# EAGLE board csa_auxcpu-v1.0c (EAGLE 4.15)
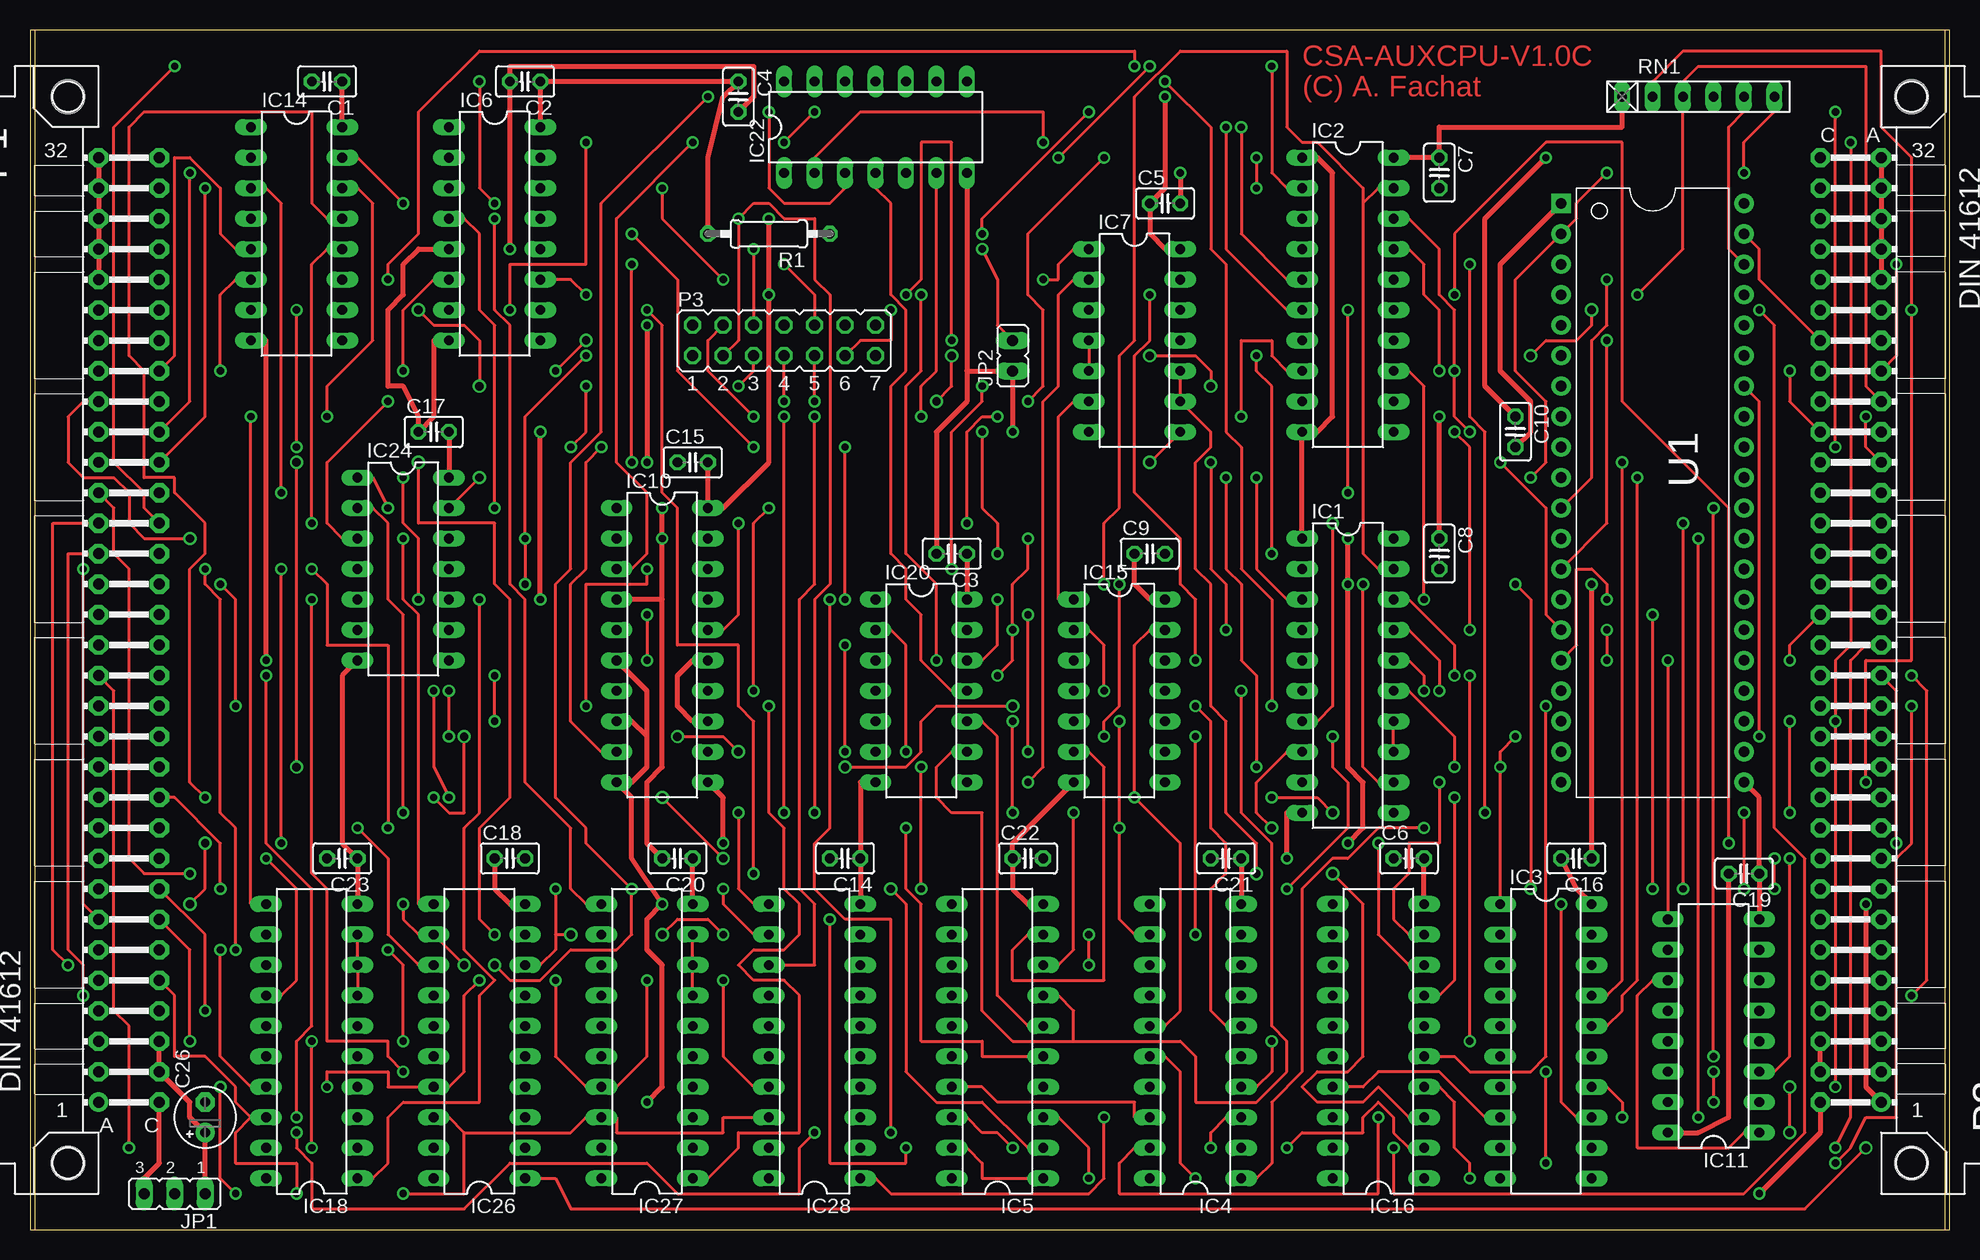
[diagram p2: board, top side]
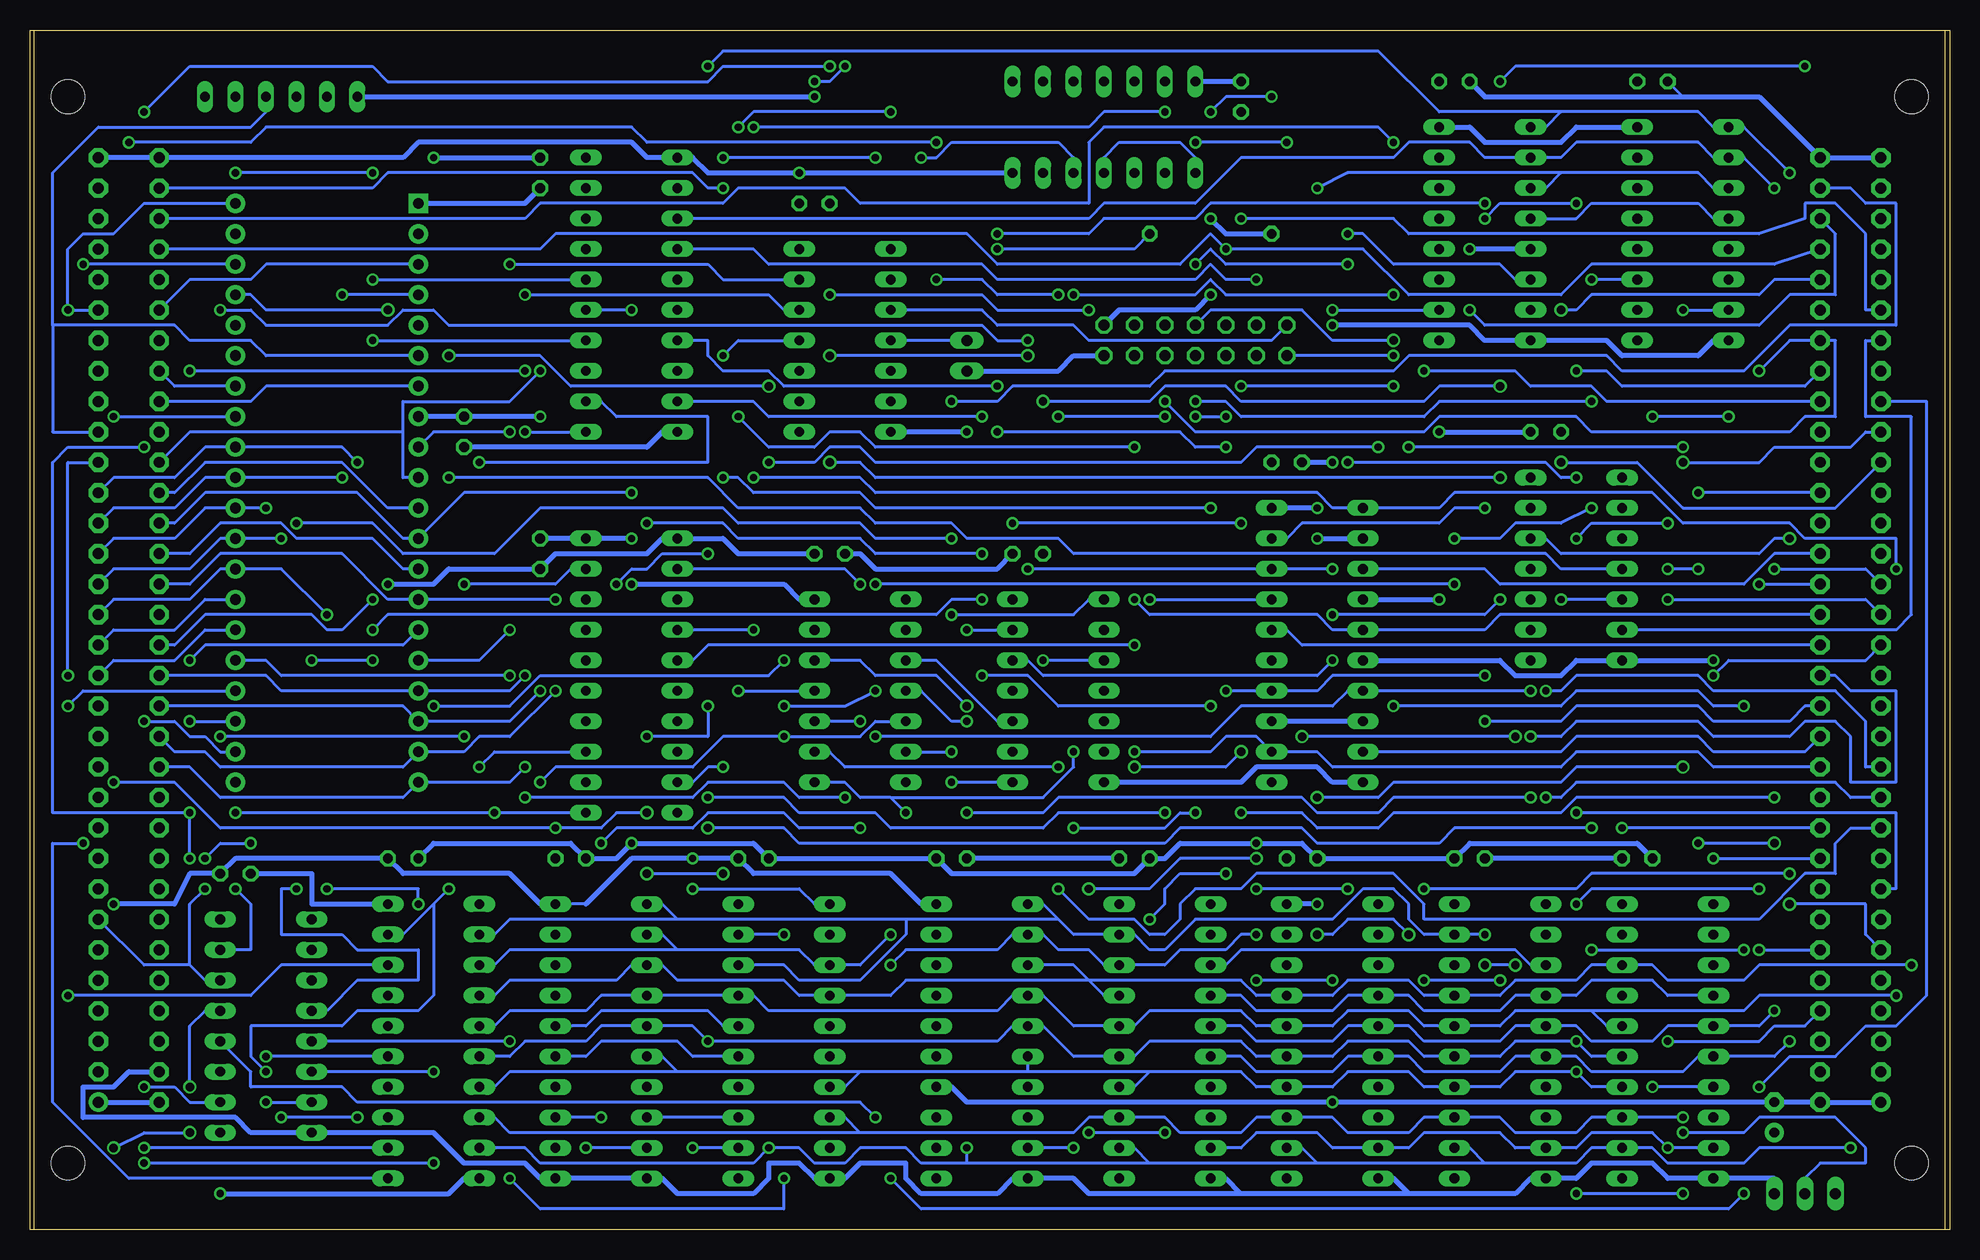
[diagram p3: board, bottom side, seen from below]

Size 160 x 100.03 mm. Coordinates in mm from the lower left corner, seen from the top.
Outline: 0,0.01 160,0.01 160,100.01 0,100.01 0,0.01
Copper layers (1*16): Top 0.035mm / dielectric 1.5mm / Bottom 0.035mm
Design rules "default": minimum track width 10mil, minimum drill 24mil, track to track 8mil, track to pad 8mil, pad to pad 8mil, via to via 8mil, smd to smd 8mil, copper to edge 40mil, drill to drill 8mil, minimum pad ring 10mil, minimum via ring 8mil, stop-mask expansion 4mil, vias tented up to drill 0mil, thermal gap 10mil

## Footprints (pad centres in the part's own frame; a part is rotated, then mirrored left to right if it is on the bottom)
C025-025X050 = drill 0.813 octagon: 1 -1.27,0; 2 1.27,0
E2,5-5 = drill 0.813 pad 1.6 round: + -1.27,0 | drill 0.813 pad 1.6 octagon: - 1.27,0
DIL20 = drill 0.813 long: 1 -11.43,-3.81; 2 -8.89,-3.81; 3 -6.35,-3.81; 4 -3.81,-3.81; 5 -1.27,-3.81; 6 1.27,-3.81; 7 3.81,-3.81; 8 6.35,-3.81; 9 8.89,-3.81; 10 11.43,-3.81; 11 11.43,3.81; 12 8.89,3.81; 13 6.35,3.81; 14 3.81,3.81; 15 1.27,3.81; 16 -1.27,3.81; 17 -3.81,3.81; 18 -6.35,3.81; 19 -8.89,3.81; 20 -11.43,3.81
DIL20' = drill 0.813 long: 1 -10.16,-3.81; 2 -7.62,-3.81; 3 -5.08,-3.81; 4 -2.54,-3.81; 5 0,-3.81; 6 2.54,-3.81; 7 5.08,-3.81; 8 7.62,-3.81; 9 10.16,-3.81; 10 12.7,-3.81; 11 12.7,3.81; 12 10.16,3.81; 13 7.62,3.81; 14 5.08,3.81; 15 2.54,3.81; 16 0,3.81; 17 -2.54,3.81; 18 -5.08,3.81; 19 -7.62,3.81; 20 -10.16,3.81
DIL16 = drill 0.813 long: 1 -8.89,-3.81; 2 -6.35,-3.81; 3 -3.81,-3.81; 4 -1.27,-3.81; 5 1.27,-3.81; 6 3.81,-3.81; 7 6.35,-3.81; 8 8.89,-3.81; 9 8.89,3.81; 10 6.35,3.81; 11 3.81,3.81; 12 1.27,3.81; 13 -1.27,3.81; 14 -3.81,3.81; 15 -6.35,3.81; 16 -8.89,3.81
DIL14 = drill 0.813 long: 1 -7.62,-3.81; 2 -5.08,-3.81; 3 -2.54,-3.81; 4 0,-3.81; 5 2.54,-3.81; 6 5.08,-3.81; 7 7.62,-3.81; 8 7.62,3.81; 9 5.08,3.81; 10 2.54,3.81; 11 0,3.81; 12 -2.54,3.81; 13 -5.08,3.81; 14 -7.62,3.81
JP2 = drill 0.914 long: 1 -2.54,0; 2 0,0; 3 2.54,0
JP1 = drill 0.914 long: 1 0,-1.27; 2 0,1.27
CSABUS = drill 0.914 pad 1.6 round: A1 7.62,36.83 | drill 0.914 pad 1.6 octagon: A2 7.62,34.29; A3 7.62,31.75; A4 7.62,29.21; A5 7.62,26.67; A6 7.62,24.13; A7 7.62,21.59; A8 7.62,19.05; A9 7.62,16.51; A10 7.62,13.97; A11 7.62,11.43; A12 7.62,8.89; A13 7.62,6.35; A14 7.62,3.81; A15 7.62,1.27; A16 7.62,-1.27; A17 7.62,-3.81; A18 7.62,-6.35; A19 7.62,-8.89; A20 7.62,-11.43; A21 7.62,-13.97; A22 7.62,-16.51; A23 7.62,-19.05; A24 7.62,-21.59; A25 7.62,-24.13; A26 7.62,-26.67; A27 7.62,-29.21; A28 7.62,-31.75; A29 7.62,-34.29; A30 7.62,-36.83; A31 7.62,-39.37; A32 7.62,-41.91; C1 2.54,36.83; C2 2.54,34.29; C3 2.54,31.75; C4 2.54,29.21; C5 2.54,26.67; C6 2.54,24.13; C7 2.54,21.59; C8 2.54,19.05; C9 2.54,16.51; C10 2.54,13.97; C11 2.54,11.43; C12 2.54,8.89; C13 2.54,6.35; C14 2.54,3.81; C15 2.54,1.27; C16 2.54,-1.27; C17 2.54,-3.81; C18 2.54,-6.35; C19 2.54,-8.89; C20 2.54,-11.43; C21 2.54,-13.97; C22 2.54,-16.51; C23 2.54,-19.05; C24 2.54,-21.59; C25 2.54,-24.13; C26 2.54,-26.67; C27 2.54,-29.21; C28 2.54,-31.75; C29 2.54,-34.29; C30 2.54,-36.83; C31 2.54,-39.37; C32 2.54,-41.91 | hole 2.794: 10.16,41.91; 10.16,-46.99
CSABUSSOCK = drill 0.914 pad 1.6 round: A1 -7.62,-39.37 | drill 0.914 pad 1.6 octagon: A2 -7.62,-36.83; A3 -7.62,-34.29; A4 -7.62,-31.75; A5 -7.62,-29.21; A6 -7.62,-26.67; A7 -7.62,-24.13; A8 -7.62,-21.59; A9 -7.62,-19.05; A10 -7.62,-16.51; A11 -7.62,-13.97; A12 -7.62,-11.43; A13 -7.62,-8.89; A14 -7.62,-6.35; A15 -7.62,-3.81; A16 -7.62,-1.27; A17 -7.62,1.27; A18 -7.62,3.81; A19 -7.62,6.35; A20 -7.62,8.89; A21 -7.62,11.43; A22 -7.62,13.97; A23 -7.62,16.51; A24 -7.62,19.05; A25 -7.62,21.59; A26 -7.62,24.13; A27 -7.62,26.67; A28 -7.62,29.21; A29 -7.62,31.75; A30 -7.62,34.29; A31 -7.62,36.83; A32 -7.62,39.37; C1 -12.7,-39.37; C2 -12.7,-36.83; C3 -12.7,-34.29; C4 -12.7,-31.75; C5 -12.7,-29.21; C6 -12.7,-26.67; C7 -12.7,-24.13; C8 -12.7,-21.59; C9 -12.7,-19.05; C10 -12.7,-16.51; C11 -12.7,-13.97; C12 -12.7,-11.43; C13 -12.7,-8.89; C14 -12.7,-6.35; C15 -12.7,-3.81; C16 -12.7,-1.27; C17 -12.7,1.27; C18 -12.7,3.81; C19 -12.7,6.35; C20 -12.7,8.89; C21 -12.7,11.43; C22 -12.7,13.97; C23 -12.7,16.51; C24 -12.7,19.05; C25 -12.7,21.59; C26 -12.7,24.13; C27 -12.7,26.67; C28 -12.7,29.21; C29 -12.7,31.75; C30 -12.7,34.29; C31 -12.7,36.83; C32 -12.7,39.37 | hole 2.794: -5.08,44.45; -5.08,-44.45
FLAT14 = drill 0.914 octagon: 1 -7.62,-1.27; 2 -5.08,-1.27; 3 -2.54,-1.27; 4 0,-1.27; 5 2.54,-1.27; 6 5.08,-1.27; 7 7.62,-1.27; A -7.62,1.27; B -5.08,1.27; C -2.54,1.27; D 0,1.27; E 2.54,1.27; F 5.08,1.27; G 7.62,1.27
0207/10 = drill 0.813 octagon: 1 -5.08,0; 2 5.08,0
RN-6 = drill 0.813 long: 1 -6.35,0; 2 -3.81,0; 3 -1.27,0; 4 1.27,0; 5 3.81,0; 6 6.35,0
DIP-40 = drill 0.889 pad 1.6 square: 1 -22.86,-7.62 | drill 0.889 pad 1.6 round: 2 -20.32,-7.62; 3 -17.78,-7.62; 4 -15.24,-7.62; 5 -12.7,-7.62; 6 -10.16,-7.62; 7 -7.62,-7.62; 8 -5.08,-7.62; 9 -2.54,-7.62; 10 0,-7.62; 11 2.54,-7.62; 12 5.08,-7.62; 13 7.62,-7.62; 14 10.16,-7.62; 15 12.7,-7.62; 16 15.24,-7.62; 17 17.78,-7.62; 18 20.32,-7.62; 19 22.86,-7.62; 20 25.4,-7.62; 21 25.4,7.62; 22 22.86,7.62; 23 20.32,7.62; 24 17.78,7.62; 25 15.24,7.62; 26 12.7,7.62; 27 10.16,7.62; 28 7.62,7.62; 29 5.08,7.62; 30 2.54,7.62; 31 0,7.62; 32 -2.54,7.62; 33 -5.08,7.62; 34 -7.62,7.62; 35 -10.16,7.62; 36 -12.7,7.62; 37 -15.24,7.62; 38 -17.78,7.62; 39 -20.32,7.62; 40 -22.86,7.62

## Placement (x,y rotation side)
C1  100n  [C025-025X050]  24.76,95.73 180 top
C2  100n  [C025-025X050]  41.27,95.73 180 top
C3  100n  [C025-025X050]  76.83,56.36 180 top
C4  100n  [C025-025X050]  59.05,94.46 270 top
C5  100n  [C025-025X050]  94.61,85.57 0 top
C6  100n  [C025-025X050]  114.93,30.96 0 top
C7  100n  [C025-025X050]  117.47,88.11 270 top
C8  100n  [C025-025X050]  117.47,56.36 270 top
C9  100n  [C025-025X050]  93.34,56.36 0 top
C10  100n  [C025-025X050]  123.82,66.52 270 top
C14  100n  [C025-025X050]  67.94,30.96 180 top
C15  100n  [C025-025X050]  55.24,63.98 0 top
C16  100n  [C025-025X050]  128.9,30.96 180 top
C17  100n  [C025-025X050]  33.65,66.52 0 top
C18  100n  [C025-025X050]  40,30.96 0 top
C19  100n  [C025-025X050]  142.87,29.69 180 top
C20  100n  [C025-025X050]  53.97,30.96 180 top
C21  100n  [C025-025X050]  99.69,30.96 180 top
C22  100n  [C025-025X050]  83.18,30.96 0 top
C23  100n  [C025-025X050]  26.03,30.96 180 top
C26  [E2,5-5]  14.6,9.37 90 top
IC1  74HCT245N  [DIL20]  109.85,46.2 270 top
IC2  74HCT245N  [DIL20]  109.85,77.95 270 top
IC3  74HCT245N  [DIL20]  126.36,15.72 270 top
IC4  74LS273BUSOPT  [DIL20']  97.15,14.45 90 top
IC5  74HCT540N  [DIL20]  80.64,15.72 90 top
IC6  74HCT138N  [DIL16]  38.73,83.03 270 top
IC7  74HCT00N  [DIL14]  92.07,74.14 270 top
IC10  74LS688BUSOPT  [DIL20']  52.7,50.01 270 top
IC11  74HCT139N  [DIL16]  140.33,16.99 90 top
IC14  74HCT138N  [DIL16]  22.22,83.03 270 top
IC15  74HCT00N  [DIL14]  90.8,44.93 270 top
IC16  74HCT245N  [DIL20]  112.39,15.72 90 top
IC18  74HCT574N  [DIL20]  23.49,15.72 90 top
IC20  74HCT08N  [DIL14]  74.29,44.93 270 top
IC22  74HCT125N  [DIL14]  70.48,91.92 0 top
IC24  74LS07N  [DIL14]  31.11,55.09 270 top
IC26  74HCT574N  [DIL20]  37.46,15.72 90 top
IC27  74HCT574N  [DIL20]  51.43,15.72 90 top
IC28  74HCT574N  [DIL20]  65.4,15.72 90 top
JP1  [JP2]  12.06,3.02 180 top
JP2  [JP1]  81.91,72.87 0 top
P1  CSABUS  [CSABUS]  13.33,47.47 180 top
P2  CSABUSSOCKET  [CSABUSSOCK]  161.92,50.01 0 top
P3  CSA_AUXCPU_ADDON  [FLAT14]  62.86,74.14 0 top
R1  47k  [0207/10]  61.59,83.03 180 top
RN1  47k  [RN-6]  139.06,94.46 0 top
U1  [DIP-40]  135.25,62.71 270 top

## Tracks (layer width: path | path; a pad name or v marks a point on that pad's centre or on a via)
2PHI2  (via drill 0.61)
  Top 0.254: v60.32,81.76 P3.C
  Bottom 0.254: P1.C29 14.6,80.49 29.84,80.49 32.38,77.95 45.08,77.95 48.89,81.76 v60.32,81.76 61.59,83.03 64.13,80.49 79.37,80.49 81.91,83.03 116.2,83.03 117.47,81.76 P2.C29
8PHI2  (via drill 0.61)
  Top 0.254: v83.18,69.06 84.45,70.33 84.45,76.68 83.18,77.95 83.18,83.03 v89.53,89.38 | v102.23,89.38 v102.23,86.84
  Bottom 0.254: P1.C31 8.25,86.84 6.98,85.57 4.44,85.57 4.44,75.41 13.33,75.41 17.14,71.6 27.3,71.6 28.57,72.87 45.08,72.87 46.35,71.6 65.4,71.6 66.67,70.33 78.1,70.33 79.37,69.06 v83.18,69.06 | v89.53,89.38 v102.23,89.38 | v102.23,86.84 103.5,86.84 104.77,88.11 130.17,88.11 131.44,86.84 P2.C31
16MHZ  (via drill 0.61)
  Top 0.254: v40,76.68 40,80.49 46.35,80.49 v46.35,90.65
  Bottom 0.254: P1.C30 9.52,83.03 9.52,77.95 13.33,77.95 15.87,75.41 38.73,75.41 v40,76.68 | v46.35,90.65 47.62,91.92 70.48,91.92 71.75,90.65 71.75,85.57 90.8,85.57 92.07,86.84 100.96,86.84 102.23,85.57 117.47,85.57 118.74,84.3 P2.C30
/AUXMODE  (via drill 0.61)
  Top 0.254: v29.84,60.17 28.57,62.71 IC24.1 | v46.35,72.87 41.27,67.79 v41.27,57.63 v41.27,53.82 | 111.12,85.57 111.12,56.36 112.39,55.09 IC1.19 | 111.12,85.57 112.39,86.84 IC2.19 | v123.82,53.82 125.09,52.55 v125.09,28.42 | v140.33,13.18 v140.33,10.64 | v89.53,53.82 89.53,58.9 90.8,60.17 90.8,72.87 92.07,74.14 92.07,94.46 95.88,98.27 104.77,98.27 104.77,91.92 106.04,90.65 107.31,90.65 111.12,86.84 111.12,85.57
  Bottom 0.254: v29.84,60.17 32.38,58.9 36.19,58.9 37.46,57.63 v41.27,57.63 | v46.35,72.87 P3.1 | v125.09,28.42 126.36,27.15 | 126.36,27.15 128.9,24.61 IC3.19 | v123.82,53.82 116.2,53.82 114.93,55.09 IC1.19 | v140.33,13.18 141.6,14.45 141.6,16.99 133.98,16.99 132.71,18.26 127.63,18.26 126.36,19.53 126.36,27.15 | v140.33,10.64 IC11.15 | v41.27,53.82 v89.53,53.82
/BE  (via drill 0.61)
  Top 0.254: v31.11,34.77 31.11,51.28 29.84,52.55 29.84,58.9 28.57,60.17 IC24.2
  Bottom 0.254: v31.11,34.77 4.44,34.77 4.44,28.42 P1.A8
/BIOSEL  (via drill 0.61)
  Top 0.254: v99.69,62.71 99.69,55.09 100.96,53.82 100.96,47.47 102.23,46.2 v102.23,38.58 | P1.A7 4.44,27.15 v4.44,55.09
  Bottom 0.254: v102.23,38.58 103.5,38.58 104.77,37.31 IC1.9 | v4.44,55.09 4.44,57.63 12.06,57.63 13.33,58.9 22.22,58.9 24.76,61.44 41.27,61.44 42.54,60.17 IC10.1 51.43,60.17 52.7,61.44 89.53,61.44 90.8,62.71 v99.69,62.71
/BIRQ  (via drill 0.61, 0.7)
  Top 0.254: v17.14,3.02 15.87,4.29 v15.87,11.91 | IC5.3 85.72,9.37 88.26,6.83 v88.26,4.29 | v13.33,57.63 9.52,57.63 8.25,58.9 8.25,61.44 6.98,62.71 4.44,62.71 3.17,63.98 3.17,67.79 4.44,69.06 P1.A24
  Bottom 0.254: v88.26,4.29 85.72,1.75 18.41,1.75 v17.14,3.02 | v15.87,11.91 13.33,14.45 9.52,14.45 6.98,16.99 4.44,16.99 1.9,19.53 1.9,69.06 P1.A24 | IC24.12 33.65,57.63 32.38,56.36 15.87,56.36 14.6,57.63 v13.33,57.63
/BMEMSEL  (via drill 0.61, 0.7)
  Top 0.254: IC1.8 104.77,39.85 102.23,37.31 102.23,34.77 v103.5,33.5 | v13.33,27.15 14.6,28.42 v14.6,32.23 | v20.95,32.23 v20.95,55.09 | v23.49,55.09 24.76,53.82 24.76,48.74 29.84,48.74 v29.84,33.5
  Bottom 0.254: v103.5,33.5 97.15,33.5 95.88,32.23 65.4,32.23 64.13,33.5 53.97,33.5 52.7,32.23 42.54,32.23 41.27,33.5 v29.84,33.5 | P1.A6 6.98,24.61 6.98,27.15 v13.33,27.15 | v14.6,32.23 v20.95,32.23 | v20.95,55.09 v23.49,55.09
/BNMI  (via drill 0.7)
  Top 0.254: IC5.2 83.18,6.83 79.37,10.64 75.56,10.64 73.02,13.18 73.02,27.15 v71.75,28.42 | v22.22,38.58 v22.22,63.98 | v52.7,36.04 v57.78,30.96
  Bottom 0.254: v71.75,28.42 66.67,28.42 64.13,30.96 v57.78,30.96 | P1.A23 6.98,66.52 8.25,65.25 14.6,65.25 15.87,63.98 v22.22,63.98 | v22.22,38.58 31.11,38.58 32.38,37.31 46.35,37.31 47.62,36.04 v52.7,36.04
/CIOSEL  (via drill 0.61)
  Top 0.254: v118.74,77.95 118.74,83.03 126.36,90.65 132.71,90.65 132.71,69.06 141.6,60.17 v141.6,32.23 | v145.41,28.42 v145.41,30.96
  Bottom 0.254: 146.68,22.07 145.41,20.8 IC11.6 | 146.68,22.07 150.49,22.07 P2.A7 | v118.74,77.95 98.42,77.95 97.15,76.68 IC7.12 | v141.6,32.23 144.14,32.23 v145.41,30.96 | v145.41,28.42 146.68,27.15 146.68,22.07
/CIRQ  (via drill 0.61)
  Top 0.254: P2.A24 153.03,70.33 153.03,97 139.06,97 137.79,95.73 RN1.3 137.79,81.76 v133.98,77.95
  Bottom 0.254: U1.4 v133.98,77.95
/CNMI
  Bottom 0.254: 158.11,75.41 158.11,66.52 P2.A23 | 158.11,75.41 158.11,88.11 154.3,91.92 141.6,91.92 140.33,93.19 RN1.4 | U1.6 140.33,72.87 141.6,74.14 146.68,74.14 147.95,75.41 158.11,75.41
/ENA1213
  Top 0.254: IC20.11 76.83,44.93 74.29,47.47 74.29,51.28 73.02,52.55 73.02,55.09 71.75,56.36 71.75,70.33 73.02,71.6 73.02,76.68 71.75,77.95 71.75,85.57 70.48,86.84 IC22.4
  Bottom 0.254: IC22.1 62.86,89.38 64.13,90.65 69.21,90.65 70.48,89.38 IC22.4
/IOSEL  (via drill 0.61)
  Top 0.254: v142.87,34.77 v142.87,28.42 | v121.28,34.77 121.28,66.52 120.01,67.79 v120.01,80.49
  Bottom 0.254: v142.87,34.77 v121.28,34.77 IC1.11 | v142.87,28.42 141.6,27.15 141.6,23.34 IC11.7 | v120.01,80.49 103.5,80.49 102.23,79.22 IC7.13
/MEMSEL  (via drill 0.61)
  Top 0.254: v103.5,56.36 103.5,70.33 102.23,71.6 v102.23,72.87 | v111.12,53.82 111.12,38.58 112.39,37.31 IC1.12
  Bottom 0.254: v111.12,53.82 109.85,55.09 108.58,55.09 107.31,56.36 v103.5,56.36 | v102.23,72.87 100.96,74.14 IC7.11
/MYIO  (via drill 0.61)
  Top 0.254: v38.73,60.17 38.73,75.41 37.46,76.68 37.46,83.03 36.19,84.3 IC6.4
  Bottom 0.254: IC14.4 19.68,84.3 20.95,85.57 29.84,85.57 31.11,84.3 IC6.4 | v38.73,60.17 41.27,60.17 42.54,58.9 53.97,58.9 55.24,57.63 IC10.19
/RDCTRL  (via drill 0.61)
  Top 0.254: v46.35,77.95 45.08,79.22 IC6.11 | v73.02,77.95 74.29,79.22 74.29,90.65 76.83,90.65 v76.83,74.14 | v144.14,76.68 145.41,75.41 145.41,33.5 147.95,30.96 147.95,8.1 142.87,3.02 113.66,3.02 v113.66,6.83
  Bottom 0.254: v73.02,77.95 62.86,77.95 61.59,79.22 60.32,77.95 v46.35,77.95 | v76.83,74.14 79.37,74.14 80.64,75.41 125.09,75.41 126.36,76.68 128.9,76.68 130.17,75.41 140.33,75.41 141.6,76.68 v144.14,76.68 | IC16.19 v113.66,6.83
/RDSTAT  (via drill 0.61)
  Top 0.254: IC5.1 79.37,4.29 79.37,5.56 78.1,6.83 IC5.19 | v51.43,76.68 52.7,75.41 52.7,61.44 53.97,60.17 53.97,48.74 59.05,48.74 59.05,43.66 60.32,42.39 v60.32,29.69 | v66.67,25.88 66.67,5.56 73.02,5.56 v73.02,6.83
  Bottom 0.254: v60.32,29.69 64.13,29.69 65.4,28.42 65.4,27.15 v66.67,25.88 | v51.43,76.68 IC6.10 | v73.02,6.83 IC5.19
/RES  (via drill 0.61, 0.7)
  Top 0.254: P3.2 59.05,74.14 v59.05,84.3 60.32,85.57 61.59,85.57 62.86,84.3 65.4,84.3 65.4,79.22 66.67,77.95 66.67,53.82 65.4,52.55 v65.4,34.77 | v153.03,37.31 153.03,47.47 156.84,47.47 v156.84,76.68 156.84,89.38 154.3,91.92 154.3,98.27 137.79,98.27 135.25,95.73 RN1.2 | IC4.1 102.23,4.29 103.5,5.56 103.5,10.64 106.04,13.18 106.04,28.42 108.58,30.96 109.85,30.96 112.39,33.5 v116.2,33.5 | v103.5,36.04 107.31,36.04 v108.58,34.77
  Bottom 0.254: v59.05,84.3 46.35,84.3 45.08,83.03 15.87,83.03 12.06,84.3 12.06,85.57 9.52,85.57 6.98,83.03 6.98,76.68 P1.A27 | v153.03,37.31 147.95,37.31 144.14,33.5 v116.2,33.5 112.39,33.5 111.12,34.77 v108.58,34.77 | P2.A27 v156.84,76.68 156.84,81.76 155.57,83.03 153.03,83.03 150.49,85.57 U1.40 | v103.5,36.04 97.15,36.04 95.88,34.77 89.53,34.77 88.26,33.5 75.56,33.5 74.29,34.77 v65.4,34.77
/SELMAP0  (via drill 0.61)
  Top 0.254: v89.53,9.37 89.53,4.29 88.26,3.02 71.75,3.02 70.48,4.29 IC28.1
  Bottom 0.254: v89.53,9.37 90.8,10.64 132.71,10.64 133.98,11.91 141.6,11.91 141.6,13.18 IC11.4
/SELMAP1  (via drill 0.7)
  Top 0.254: IC26.1 43.81,4.29 45.08,1.75 147.95,1.75 v153.03,6.83 | v146.68,8.1 v146.68,11.91
  Bottom 0.254: v153.03,6.83 150.49,8.1 v146.68,8.1 | v146.68,11.91 146.68,16.99 145.41,18.26 IC11.5
/SELRAM  (via drill 0.61)
  Top 0.254: v80.64,46.2 81.91,47.47 v81.91,50.01 81.91,53.82 83.18,55.09 v83.18,57.63 | IC27.1 56.51,4.29 59.05,6.83 59.05,8.1 64.13,8.1 64.13,19.53 62.86,20.8 60.32,20.8 59.05,22.07 60.32,23.34 62.86,23.34 64.13,24.61 64.13,27.15 62.86,28.42 62.86,33.5 61.59,34.77 v61.59,43.66 | v137.79,58.9 v137.79,28.42
  Bottom 0.254: v61.59,43.66 74.29,43.66 76.83,46.2 v80.64,46.2 | v81.91,50.01 IC20.13 | v137.79,28.42 139.06,28.42 139.06,24.61 133.98,24.61 132.71,23.34 127.63,23.34 127.63,20.8 132.71,20.8 135.25,18.26 IC11.12 | v137.79,58.9 131.44,58.9 128.9,56.36 121.28,56.36 117.47,60.17 102.23,60.17 100.96,58.9 90.8,58.9 89.53,57.63 v83.18,57.63
/SELROM  (via drill 0.61)
  Top 0.254: v37.46,52.55 37.46,34.77 36.19,33.5 36.19,23.34 38.73,20.8 37.46,19.53 37.46,10.64 31.11,10.64 29.84,9.37 29.84,5.56 28.57,4.29 IC18.1 | v51.43,51.28 v51.43,47.47 | v136.52,47.47 IC11.9 | v131.44,50.01 v131.44,47.47 | v80.64,52.55 80.64,48.74 79.37,47.47 IC20.12
  Bottom 0.254: v37.46,52.55 38.73,51.28 v51.43,51.28 | v51.43,47.47 52.7,46.2 75.56,46.2 76.83,47.47 IC20.12 | v131.44,47.47 v136.52,47.47 | v131.44,50.01 130.17,51.28 84.45,51.28 83.18,52.55 v80.64,52.55
/SYNCERR  (via drill 0.61)
  Top 0.254: v73.02,33.5 73.02,28.42 74.29,27.15 74.29,15.72 79.37,15.72 79.37,14.45 IC5.5 | v62.86,34.77 v62.86,67.79 | v60.32,67.79 56.51,71.6 56.51,74.14 P3.B
  Bottom 0.254: v73.02,33.5 65.4,33.5 64.13,34.77 v62.86,34.77 | v62.86,67.79 v60.32,67.79
/WDONE  (via drill 0.61)
  Top 0.254: v22.22,65.25 v22.22,76.68 | v45.08,65.25 46.35,66.52 v46.35,70.33 | v59.05,70.33 60.32,71.6 P3.3
  Bottom 0.254: v22.22,65.25 v45.08,65.25 | v46.35,70.33 v59.05,70.33 | v22.22,76.68 IC14.7
/WMAP0  (via drill 0.61)
  Top 0.254: v59.05,34.77 59.05,28.42 60.32,27.15 IC28.11 | v14.6,36.04 13.33,37.31 13.33,55.09 14.6,56.36 14.6,58.9 12.06,61.44 12.06,62.71 9.52,62.71 9.52,71.6 8.25,72.87 8.25,91.92 9.52,93.19 23.49,93.19 23.49,85.57 24.76,84.3 IC14.13
  Bottom 0.254: v59.05,34.77 53.97,34.77 52.7,33.5 47.62,33.5 46.35,34.77 32.38,34.77 31.11,36.04 v14.6,36.04
/WMAP1  (via drill 0.61)
  Top 0.254: v31.11,57.63 31.11,52.55 32.38,51.28 32.38,27.15 IC26.11 | v23.49,58.9 23.49,80.49 24.76,81.76 IC14.12
  Bottom 0.254: v31.11,57.63 29.84,58.9 v23.49,58.9
/WMAPRAM  (via drill 0.61)
  Top 0.254: v38.73,84.3 38.73,76.68 40,75.41 40,53.82 41.27,52.55 41.27,37.31 45.08,33.5 45.08,28.42 46.35,27.15 IC27.11 | v31.11,85.57 27.3,89.38 IC14.15
  Bottom 0.254: v38.73,84.3 37.46,85.57 v31.11,85.57
/WMAPROM  (via drill 0.61)
  Top 0.254: v18.41,67.79 18.41,27.15 IC18.11 | v24.76,67.79 24.76,70.33 28.57,74.14 28.57,85.57 27.3,86.84 IC14.14
  Bottom 0.254: v18.41,67.79 v24.76,67.79
/WRCTRL  (via drill 0.61)
  Top 0.254: v29.84,79.22 29.84,80.49 32.38,83.03 32.38,93.19 37.46,98.27 92.07,98.27 v92.07,97 | v94.61,95.73 98.42,91.92 98.42,81.76 99.69,80.49 99.69,66.52 100.96,65.25 100.96,55.09 103.5,52.55 v103.5,43.66 | v108.58,41.12 108.58,38.58 109.85,37.31 109.85,33.5 v104.77,28.42
  Bottom 0.254: v92.07,97 93.34,95.73 v94.61,95.73 | v103.5,43.66 103.5,41.12 v108.58,41.12 | v104.77,28.42 95.88,28.42 94.61,27.15 IC4.11 | IC14.11 v29.84,79.22
AIRQ  (via drill 0.61, 0.7)
  Top 0.254: IC7.10 IC7.9 98.42,66.52 98.42,65.25 97.15,63.98 97.15,55.09 98.42,53.82 98.42,43.66 99.69,42.39 99.69,34.77 102.23,32.23 v102.23,29.69 | v108.58,29.69 111.12,27.15 111.12,14.45 109.85,13.18 107.31,13.18 106.04,11.91 107.31,10.64 111.12,10.64 112.39,11.91 114.93,9.37 IC16.3 | v112.39,9.37 112.39,3.02 90.8,3.02 90.8,5.56 92.07,6.83 IC4.19
  Bottom 0.254: v108.58,29.69 v102.23,29.69 | v112.39,9.37 IC16.3
AUXRDY  (via drill 0.61)
  Top 0.254: v125.09,62.71 126.36,63.98 126.36,69.06 123.82,71.6 123.82,79.22 U1.2 128.9,84.3 128.9,85.57 v131.44,88.11 | v142.87,88.11 142.87,90.65 145.41,93.19 RN1.6
  Bottom 0.254: v125.09,62.71 103.5,62.71 100.96,60.17 90.8,60.17 89.53,58.9 83.18,58.9 81.91,57.63 74.29,57.63 73.02,56.36 33.65,56.36 32.38,55.09 IC24.4 | v131.44,88.11 v142.87,88.11
AUXRDYOUT  (via drill 0.61)
  Top 0.254: v29.84,69.06 24.76,63.98 24.76,58.9 26.03,57.63 IC24.3 | v62.86,69.06 P3.4
  Bottom 0.254: v29.84,69.06 42.54,69.06 43.81,67.79 59.05,67.79 60.32,69.06 v62.86,69.06
BA0  (via drill 0.61)
  Top 0.254: v103.5,97 103.5,88.11 104.77,86.84 IC2.2 | P1.C23 13.33,69.06 v13.33,88.11
  Bottom 0.254: 32.38,93.19 20.95,93.19 19.68,91.92 IC14.1 17.14,91.92 v13.33,88.11 | 32.38,93.19 33.65,91.92 IC6.1 | v103.5,97 102.23,98.27 47.62,98.27 42.54,93.19 32.38,93.19
BA1  (via drill 0.61)
  Top 0.254: P1.C22 14.6,67.79 v14.6,86.84
  Bottom 0.254: IC2.3 71.75,84.3 70.48,85.57 62.86,85.57 59.05,89.38 46.35,89.38 45.08,90.65 40,90.65 38.73,89.38 IC6.2 32.38,89.38 31.11,90.65 20.95,90.65 19.68,89.38 IC14.2 17.14,89.38 v14.6,86.84
BA2  (via drill 0.61)
  Top 0.254: v57.78,79.22 52.7,84.3 v52.7,86.84 | v20.95,61.44 20.95,85.57 19.68,86.84 IC14.3
  Bottom 0.254: 32.38,88.11 20.95,88.11 19.68,86.84 IC14.3 | 32.38,88.11 33.65,86.84 IC6.3 | v57.78,79.22 60.32,79.22 61.59,80.49 62.86,79.22 79.37,79.22 80.64,80.49 98.42,80.49 99.69,81.76 IC2.4 | v52.7,86.84 50.16,88.11 32.38,88.11 | P1.C21 v20.95,61.44
BA3  (via drill 0.61)
  Top 0.254: v100.96,91.92 100.96,83.03 104.77,79.22 IC2.5 | v38.73,85.57 37.46,86.84 v37.46,95.73 | v12.06,97 6.98,91.92 6.98,63.98 9.52,61.44 9.52,60.17 P1.C20 | v79.37,83.03 79.37,84.3 v88.26,93.19
  Bottom 0.254: v100.96,91.92 99.69,93.19 v88.26,93.19 | v38.73,85.57 61.59,85.57 62.86,84.3 70.48,84.3 71.75,83.03 v79.37,83.03 | v37.46,95.73 36.19,97 v12.06,97
BA4  (via drill 0.61)
  Top 0.254: v99.69,91.92 99.69,81.76 104.77,76.68 IC2.6 | v62.86,90.65 v65.4,93.19 | v55.24,90.65 48.89,84.3 48.89,63.98 51.43,61.44 51.43,56.36 50.16,55.09 IC10.3
  Bottom 0.254: P1.C19 14.6,56.36 17.14,53.82 37.46,53.82 38.73,55.09 IC10.3 | v99.69,91.92 71.75,91.92 70.48,93.19 v65.4,93.19 | v55.24,90.65 v62.86,90.65
BA5  (via drill 0.61)
  Top 0.254: v76.83,55.09 76.83,66.52 79.37,69.06 v79.37,70.33 | v15.87,53.82 17.14,52.55 v17.14,43.66 | v46.35,43.66 46.35,53.82 51.43,53.82 v51.43,55.09
  Bottom 0.254: v79.37,70.33 97.15,70.33 98.42,71.6 102.23,71.6 103.5,72.87 103.5,74.14 IC2.7 | v76.83,55.09 IC10.18 v51.43,55.09 | v15.87,53.82 P1.C18 | v17.14,43.66 19.68,43.66 20.95,44.93 31.11,44.93 32.38,43.66 v46.35,43.66
BA6  (via drill 0.61)
  Top 0.254: v100.96,67.79 100.96,74.14 103.5,74.14 103.5,72.87 104.77,71.6 IC2.8 | v67.94,52.55 v67.94,65.25
  Bottom 0.254: P1.C17 37.46,51.28 38.73,50.01 IC10.5 51.43,50.01 52.7,51.28 66.67,51.28 v67.94,52.55 | v100.96,67.79 98.42,65.25 94.61,65.25 93.34,66.52 90.8,66.52 89.53,65.25 v67.94,65.25
BA7  (via drill 0.61)
  Top 0.254: v78.1,58.9 78.1,66.52 79.37,67.79 v80.64,67.79 | v59.05,58.9 59.05,51.28 57.78,50.01 IC10.16
  Bottom 0.254: P1.C16 53.97,48.74 55.24,50.01 IC10.16 | v80.64,67.79 98.42,67.79 99.69,69.06 IC2.9 | v59.05,58.9 v78.1,58.9
BA8  (via drill 0.61)
  Top 0.254: v34.92,41.12 v34.92,44.93 | v90.8,53.82 90.8,43.66 89.53,42.39 v89.53,41.12
  Bottom 0.254: v34.92,41.12 32.38,41.12 31.11,42.39 20.95,42.39 19.68,41.12 13.33,41.12 12.06,42.39 9.52,42.39 8.25,41.12 8.25,37.31 4.44,37.31 4.44,44.93 8.25,44.93 9.52,46.2 P1.C15 | v34.92,44.93 IC10.7 50.16,44.93 51.43,43.66 59.05,43.66 61.59,41.12 v89.53,41.12 | v90.8,53.82 92.07,55.09 IC1.2
BA9  (via drill 0.61)
  Top 0.254: v38.73,42.39 v38.73,46.2 | v102.23,62.71 102.23,55.09 104.77,52.55 IC1.3 | v61.59,60.17 60.32,58.9 v60.32,44.93
  Bottom 0.254: v38.73,46.2 51.43,46.2 52.7,44.93 IC10.14 v60.32,44.93 | v38.73,42.39 32.38,42.39 31.11,43.66 20.95,43.66 19.68,42.39 13.33,42.39 12.06,43.66 P1.C14 | v61.59,60.17 89.53,60.17 90.8,61.44 99.69,61.44 100.96,62.71 v102.23,62.71
BA10  (via drill 0.61)
  Top 0.254: v98.42,63.98 98.42,55.09 99.69,53.82 v99.69,50.01 | v47.62,65.25 46.35,63.98 46.35,55.09 45.08,53.82 45.08,42.39 47.62,39.85 IC10.9
  Bottom 0.254: P1.C13 12.06,39.85 19.68,39.85 20.95,41.12 31.11,41.12 32.38,39.85 IC10.9 | v98.42,63.98 94.61,63.98 93.34,65.25 90.8,65.25 89.53,63.98 59.05,63.98 57.78,65.25 v47.62,65.25 | v99.69,50.01 IC1.4
BA11  (via drill 0.61)
  Top 0.254: v67.94,39.85 v67.94,48.74
  Bottom 0.254: P1.C12 19.68,38.58 20.95,39.85 31.11,39.85 32.38,38.58 51.43,38.58 52.7,39.85 IC10.12 57.78,41.12 60.32,41.12 61.59,39.85 v67.94,39.85 | v67.94,48.74 103.5,48.74 104.77,47.47 IC1.5
BA12  (via drill 0.61, 0.7)
  Top 0.254: v31.11,27.15 31.11,25.88 32.38,24.61 IC26.12 v36.19,22.07 | v15.87,28.42 15.87,32.23 12.06,36.04 P1.C11 | v57.78,28.42 57.78,27.15 60.32,24.61 IC28.12 | v61.59,93.19 61.59,86.84 62.86,85.57 66.67,85.57 67.94,86.84 IC22.3 | v56.51,94.46 47.62,85.57 47.62,66.52 45.08,63.98 45.08,55.09 43.81,53.82 43.81,36.04 46.35,33.5 46.35,32.23 v50.16,28.42 50.16,24.61 48.89,23.34 45.08,23.34 42.54,20.8 40,20.8 v38.73,22.07
  Bottom 0.254: v31.11,27.15 29.84,28.42 v15.87,28.42 | v50.16,28.42 v57.78,28.42 | v61.59,93.19 60.32,94.46 v56.51,94.46 | v36.19,22.07 v38.73,22.07
BA13  (via drill 0.61)
  Top 0.254: v65.4,67.79 65.4,53.82 64.13,52.55 64.13,28.42 65.4,27.15 65.4,22.07 IC28.13 | v74.29,67.79 74.29,70.33 75.56,71.6 IC22.6 | v27.3,33.5 29.84,30.96 29.84,24.61 32.38,22.07 IC26.13
  Bottom 0.254: IC26.13 34.92,22.07 36.19,23.34 59.05,23.34 60.32,22.07 IC28.13 | P1.C10 v27.3,33.5 | v65.4,67.79 v74.29,67.79
BA14  (via drill 0.61)
  Top 0.254: v19.68,30.96 22.22,28.42 22.22,20.8 20.95,19.53 IC18.14
  Bottom 0.254: IC28.14 59.05,19.53 57.78,18.26 51.43,18.26 50.16,19.53 IC27.14 45.08,19.53 43.81,18.26 37.46,18.26 36.19,19.53 IC26.14 31.11,19.53 29.84,20.8 24.76,20.8 23.49,19.53 IC18.14 | v19.68,30.96 P1.C9
BA15  (via drill 0.61)
  Top 0.254: P1.C8 14.6,24.61 v14.6,18.26
  Bottom 0.254: IC28.15 59.05,16.99 57.78,15.72 51.43,15.72 50.16,16.99 IC27.15 45.08,16.99 43.81,15.72 37.46,15.72 36.19,16.99 IC26.15 31.11,16.99 29.84,15.72 24.76,15.72 23.49,16.99 IC18.15 15.87,16.99 v14.6,18.26
BA16  (via drill 0.61)
  Top 0.254: P1.C7 13.33,23.34 v13.33,15.72
  Bottom 0.254: IC28.16 59.05,14.45 57.78,13.18 51.43,13.18 50.16,14.45 IC27.16 45.08,14.45 43.81,13.18 37.46,13.18 36.19,14.45 IC26.16 31.11,14.45 29.84,13.18 22.22,13.18 20.95,14.45 IC18.16 14.6,14.45 v13.33,15.72
BA17  (via drill 0.61)
  Top 0.254: v15.87,23.34 15.87,14.45 18.41,11.91 IC18.17 | v24.76,11.91 24.76,13.18 29.84,13.18 29.84,11.91 IC26.17 34.92,11.91 36.19,13.18 36.19,19.53 v37.46,20.8 | v43.81,20.8 43.81,14.45 46.35,11.91 IC27.17 48.89,11.91 51.43,14.45 v51.43,20.8 | v57.78,20.8 57.78,14.45 60.32,11.91 IC28.17
  Bottom 0.254: v15.87,23.34 P1.C6 | IC18.17 v24.76,11.91 | v37.46,20.8 v43.81,20.8 | v51.43,20.8 v57.78,20.8
BA18  (via drill 0.61)
  Top 0.254: 18.41,9.37 17.14,10.64 17.14,11.91 14.6,14.45 12.06,14.45 12.06,19.53 P1.C5 | 36.19,8.1 34.92,9.37 IC26.18 | 36.19,8.1 45.08,8.1 46.35,9.37 IC27.18 48.89,9.37 48.89,8.1 57.78,8.1 57.78,9.37 IC28.18 | 18.41,9.37 17.14,8.1 17.14,5.56 22.22,5.56 v22.22,3.02 | v31.11,3.02 36.19,3.02 36.19,8.1 | 18.41,9.37 IC18.18
  Bottom 0.254: v22.22,3.02 v31.11,3.02
BA19  (via drill 0.61)
  Top 0.254: v23.49,6.83 v23.49,15.72
  Bottom 0.254: IC28.19 59.05,6.83 57.78,8.1 52.7,8.1 51.43,6.83 IC27.19 45.08,6.83 43.81,8.1 37.46,8.1 36.19,6.83 IC26.19 31.11,6.83 29.84,8.1 24.76,8.1 v23.49,6.83 IC18.19 | P1.C4 12.06,16.99 14.6,16.99 15.87,15.72 v23.49,15.72
BD0  (via drill 0.61, 0.7)
  Top 0.254: v38.73,24.61 37.46,25.88 37.46,33.5 40,36.04 40,52.55 38.73,53.82 38.73,58.9 32.38,58.9 v32.38,63.98
  Bottom 0.254: 74.29,25.88 73.02,24.61 IC28.9 67.94,24.61 66.67,23.34 65.4,23.34 62.86,25.88 51.43,25.88 48.89,28.42 46.35,28.42 45.08,27.15 45.08,25.88 43.81,24.61 IC26.9 v38.73,24.61 | 74.29,25.88 75.56,27.15 IC5.11 | 86.99,25.88 86.99,24.61 90.8,20.8 95.88,20.8 97.15,22.07 IC4.8 | 74.29,25.88 86.99,25.88 | 106.04,25.88 107.31,27.15 IC16.11 | 86.99,25.88 106.04,25.88 | 106.04,25.88 120.01,25.88 121.28,24.61 IC3.2 | P1.A22 9.52,60.17 22.22,60.17 26.03,63.98 v32.38,63.98
BD1  (via drill 0.61, 0.7)
  Top 0.254: v88.26,22.07 v88.26,24.61 | v43.81,28.42 43.81,24.61 | 43.81,24.61 43.81,23.34 42.54,22.07 IC26.8 | v13.33,29.69 9.52,29.69 8.25,30.96 8.25,55.09 6.98,56.36 6.98,60.17 P1.A21 | v57.78,24.61 56.51,25.88 53.97,25.88 v52.7,24.61 | 43.81,24.61 v45.08,24.61
  Bottom 0.254: 106.04,23.34 95.88,23.34 94.61,22.07 IC4.13 90.8,22.07 v88.26,24.61 | 106.04,23.34 107.31,24.61 IC16.12 | 106.04,23.34 120.01,23.34 121.28,22.07 IC3.3 | v88.26,22.07 86.99,23.34 79.37,23.34 78.1,24.61 IC5.12 75.56,24.61 74.29,23.34 71.75,23.34 70.48,22.07 IC28.8 65.4,22.07 64.13,23.34 60.32,23.34 59.05,24.61 v57.78,24.61 | v43.81,28.42 31.11,28.42 29.84,29.69 v13.33,29.69 | v45.08,24.61 46.35,25.88 50.16,25.88 51.43,24.61 v52.7,24.61
BD2  (via drill 0.61)
  Top 0.254: IC27.7 IC27.8 IC27.9 | IC18.7 IC18.8 IC18.9 | P1.A20 1.9,58.9 1.9,23.34 v3.17,22.07
  Bottom 0.254: IC3.4 121.28,19.53 120.01,20.8 111.12,20.8 109.85,22.07 IC16.13 107.31,22.07 106.04,20.8 97.15,20.8 95.88,19.53 IC4.14 88.26,19.53 86.99,20.8 71.75,20.8 | 71.75,20.8 73.02,22.07 IC5.13 | 71.75,20.8 70.48,19.53 IC28.7 | 71.75,20.8 59.05,20.8 57.78,19.53 IC27.7 51.43,19.53 50.16,20.8 45.08,20.8 43.81,19.53 IC26.7 37.46,19.53 36.19,20.8 31.11,20.8 29.84,22.07 IC18.8 24.76,22.07 23.49,20.8 17.14,20.8 15.87,22.07 v3.17,22.07
BD3  (via drill 0.61)
  Top 0.254: P1.A19 3.17,56.36 3.17,23.34 4.44,22.07 v4.44,19.53
  Bottom 0.254: IC3.5 121.28,16.99 120.01,18.26 113.66,18.26 112.39,19.53 IC16.14 IC4.7 99.69,19.53 98.42,18.26 79.37,18.26 78.1,19.53 IC5.14 75.56,19.53 73.02,16.99 IC28.6 67.94,16.99 66.67,18.26 59.05,18.26 57.78,16.99 IC27.6 51.43,16.99 50.16,18.26 45.08,18.26 43.81,16.99 IC26.6 37.46,16.99 36.19,18.26 29.84,18.26 | 29.84,18.26 28.57,16.99 IC18.6 | v4.44,19.53 15.87,19.53 17.14,18.26 29.84,18.26
BD4  (via drill 0.61)
  Top 0.254: v103.5,15.72 103.5,13.18 102.23,11.91 IC4.4 | v14.6,55.09 14.6,53.82 15.87,52.55 15.87,34.77 17.14,33.5 v17.14,23.34 | v29.84,23.34 31.11,22.07 v31.11,15.72
  Bottom 0.254: IC3.6 120.01,14.45 118.74,15.72 113.66,15.72 112.39,16.99 IC16.15 104.77,16.99 v103.5,15.72 79.37,15.72 78.1,16.99 IC5.15 75.56,16.99 73.02,14.45 IC28.5 67.94,14.45 66.67,15.72 59.05,15.72 57.78,14.45 IC27.5 51.43,14.45 50.16,15.72 45.08,15.72 43.81,14.45 IC26.5 37.46,14.45 36.19,15.72 v31.11,15.72 29.84,14.45 IC18.5 | P1.A18 6.98,55.09 v14.6,55.09 | v29.84,23.34 v17.14,23.34
BD5  (via drill 0.61)
  Top 0.254: v23.49,52.55 23.49,29.69 24.76,28.42 24.76,15.72 29.84,15.72 29.84,14.45 v31.11,13.18
  Bottom 0.254: 66.67,13.18 59.05,13.18 57.78,11.91 IC27.4 51.43,11.91 50.16,13.18 45.08,13.18 43.81,11.91 IC26.4 37.46,11.91 36.19,13.18 v31.11,13.18 29.84,11.91 IC18.4 | 66.67,13.18 67.94,11.91 IC28.4 | 90.8,13.18 92.07,11.91 IC4.17 | 66.67,13.18 76.83,13.18 | 76.83,13.18 90.8,13.18 | 76.83,13.18 IC5.16 | 106.04,13.18 107.31,14.45 IC16.16 | 90.8,13.18 106.04,13.18 | 106.04,13.18 120.01,13.18 121.28,11.91 IC3.7 | P1.A17 6.98,52.55 v23.49,52.55
BD6  (via drill 0.61)
  Top 0.254: IC5.17 79.37,11.91 80.64,10.64 92.07,10.64 92.07,9.37 IC4.18 | IC16.17 111.12,11.91 112.39,13.18 117.47,13.18 121.28,9.37 IC3.8 | v19.68,46.2 19.68,32.23 23.49,28.42 23.49,16.99 22.22,15.72 v22.22,9.37
  Bottom 0.254: 90.8,8.1 92.07,9.37 IC4.18 | 90.8,8.1 73.02,8.1 71.75,9.37 IC28.3 65.4,9.37 64.13,8.1 59.05,8.1 57.78,9.37 IC27.3 51.43,9.37 50.16,8.1 45.08,8.1 43.81,9.37 IC26.3 37.46,9.37 36.19,8.1 31.11,8.1 29.84,9.37 IC18.3 v22.22,9.37 | 90.8,8.1 120.01,8.1 121.28,9.37 IC3.8 | P1.A16 6.98,47.47 18.41,47.47 v19.68,46.2
BD7  (via drill 0.61)
  Top 0.254: v81.91,6.83 80.64,8.1 79.37,8.1 78.1,9.37 IC5.18 | P1.A15 6.98,44.93 6.98,18.26 8.25,16.99 v8.25,6.83 | v98.42,6.83 98.42,8.1 99.69,9.37 IC4.3
  Bottom 0.254: IC4.3 IC16.18 | 38.73,5.56 31.11,5.56 29.84,6.83 IC18.2 24.76,6.83 23.49,5.56 17.14,5.56 15.87,6.83 v8.25,6.83 | 38.73,5.56 40,6.83 IC26.2 | 52.7,5.56 53.97,6.83 IC27.2 | 38.73,5.56 52.7,5.56 | 66.67,5.56 67.94,6.83 IC28.2 | 52.7,5.56 66.67,5.56 | 66.67,5.56 81.91,5.56 | 81.91,5.56 85.72,5.56 86.99,6.83 90.8,6.83 92.07,5.56 94.61,5.56 95.88,6.83 v98.42,6.83 99.69,5.56 117.47,5.56 118.74,6.83 IC3.9 | 81.91,5.56 v81.91,6.83
BPHI2  (via drill 0.61)
  Top 0.254: v15.87,71.6 15.87,77.95 17.14,79.22 IC14.6 | v65.4,69.06 P3.5
  Bottom 0.254: v15.87,71.6 13.33,74.14 P1.C26 9.52,74.14 9.52,67.79 12.06,67.79 13.33,66.52 29.84,66.52 31.11,67.79 42.54,67.79 43.81,66.52 62.86,66.52 v65.4,69.06
BR/-W  (via drill 0.61)
  Top 0.254: P1.C25 12.06,72.87 12.06,89.38 13.33,89.38 15.87,86.84 15.87,83.03 17.14,81.76 IC14.5 | v108.58,58.9 108.58,43.66 107.31,42.39 IC1.7 | v79.37,66.52 79.37,60.17 80.64,58.9 v80.64,56.36 | v60.32,65.25 53.97,71.6 53.97,79.22 v50.16,83.03 | v31.11,71.6 31.11,76.68 33.65,79.22 IC6.6
  Bottom 0.254: v108.58,58.9 102.23,58.9 100.96,57.63 90.8,57.63 89.53,56.36 v80.64,56.36 | v79.37,66.52 64.13,66.52 62.86,65.25 v60.32,65.25 | v50.16,83.03 48.89,83.03 46.35,80.49 37.46,80.49 36.19,79.22 IC6.6 | P1.C25 12.06,70.33 27.3,70.33 28.57,71.6 v31.11,71.6
BRDY
  Bottom 0.254: P1.A26 6.98,74.14 6.98,67.79 3.17,67.79 3.17,51.28 4.44,50.01 IC24.6
BSYNC  (via drill 0.61, 0.7)
  Top 0.254: v43.81,71.6 v46.35,74.14
  Bottom 0.254: P1.C24 28.57,69.06 29.84,70.33 34.92,70.33 36.19,71.6 v43.81,71.6 | v46.35,74.14 51.43,74.14 53.97,76.68 61.59,76.68 P3.D
CA0  (via drill 0.61)
  Top 0.254: v120.01,66.52 118.74,67.79 v118.74,71.6 118.74,76.68 117.47,77.95 117.47,81.76 114.93,84.3 IC2.18 | P2.C23 146.68,69.06 v146.68,71.6
  Bottom 0.254: v120.01,66.52 126.36,66.52 U1.9 | v118.74,71.6 v146.68,71.6
CA1  (via drill 0.61)
  Top 0.254: v117.47,71.6 117.47,76.68 116.2,77.95 116.2,80.49 114.93,81.76 IC2.17
  Bottom 0.254: v117.47,71.6 120.01,69.06 128.9,69.06 128.9,66.52 | 128.9,66.52 128.9,62.71 U1.10 | P2.C22 146.68,66.52 128.9,66.52
CA2  (via drill 0.61)
  Top 0.254: v131.44,79.22 131.44,75.41 130.17,74.14 130.17,62.71 U1.11
  Bottom 0.254: v131.44,79.22 IC2.16 | P2.C21 147.95,61.44 145.41,63.98 133.98,63.98 130.17,60.17 U1.11
CA3  (via drill 0.61)
  Top 0.254: v109.85,61.44 v109.85,76.68
  Bottom 0.254: v109.85,61.44 123.82,61.44 U1.12 128.9,57.63 132.71,61.44 145.41,61.44 147.95,58.9 P2.C20 | v109.85,76.68 IC2.15
CA4  (via drill 0.61)
  Top 0.254: v131.44,74.14 131.44,58.9 U1.13
  Bottom 0.254: v131.44,74.14 IC2.14 | P2.C19 146.68,56.36 144.14,58.9 139.06,58.9 137.79,57.63 131.44,57.63 128.9,55.09 U1.13
CA5  (via drill 0.61)
  Top 0.254: v116.2,52.55 116.2,70.33 114.93,71.6 IC2.13
  Bottom 0.254: v116.2,52.55 U1.14 130.17,52.55 133.98,56.36 144.14,56.36 146.68,53.82 P2.C18
CA6  (via drill 0.61)
  Top 0.254: v122.55,63.98 126.36,60.17 126.36,51.28 U1.15 | P2.C17 146.68,48.74 v146.68,47.47
  Bottom 0.254: v122.55,63.98 103.5,63.98 103.5,67.79 111.12,67.79 112.39,69.06 IC2.12 | v146.68,47.47 145.41,48.74 128.9,48.74 U1.15
CA7  (via drill 0.61)
  Top 0.254: v118.74,66.52 120.01,65.25 v120.01,50.01 | v131.44,52.55 131.44,53.82 130.17,55.09 128.9,55.09 128.9,48.74 U1.16
  Bottom 0.254: v120.01,50.01 122.55,47.47 U1.16 | v118.74,66.52 IC2.11 | P2.C16 147.95,48.74 145.41,51.28 136.52,51.28 135.25,50.01 133.98,50.01 v131.44,52.55
CA8  (via drill 0.61)
  Top 0.254: v118.74,46.2 118.74,48.74 114.93,52.55 IC1.18
  Bottom 0.254: v118.74,46.2 120.01,44.93 U1.17 139.06,44.93 140.33,46.2 P2.C15
CA9  (via drill 0.61)
  Top 0.254: v117.47,44.93 117.47,47.47 114.93,50.01 IC1.17
  Bottom 0.254: v117.47,44.93 120.01,42.39 U1.18 128.9,43.66 P2.C14
CA10  (via drill 0.61)
  Top 0.254: v116.2,44.93 116.2,46.2 114.93,47.47 IC1.16
  Bottom 0.254: v116.2,44.93 120.01,41.12 122.55,41.12 123.82,39.85 U1.19 128.9,38.58 144.14,38.58 145.41,39.85 147.95,39.85 P2.C13
CA11  (via drill 0.61)
  Top 0.254: v118.74,38.58 118.74,41.12 114.93,44.93 IC1.15
  Bottom 0.254: v118.74,38.58 120.01,37.31 U1.20 128.9,36.04 144.14,36.04 146.68,38.58 P2.C12
CA12  (via drill 0.61)
  Top 0.254: v150.49,11.91 v150.49,42.39 150.49,47.47 151.76,48.74 v151.76,90.65 | v84.45,90.65 84.45,93.19 69.21,93.19 65.4,89.38 IC22.2
  Bottom 0.254: v150.49,11.91 147.95,11.91 146.68,10.64 IC11.2 | v150.49,42.39 147.95,42.39 146.68,41.12 145.41,41.12 144.14,39.85 U1.22 | v84.45,90.65 108.58,90.65 109.85,91.92 140.33,91.92 141.6,90.65 v151.76,90.65
CA13  (via drill 0.61)
  Top 0.254: v146.68,30.96 146.68,14.45 145.41,13.18 IC11.3 | v146.68,34.77 v146.68,42.39 | v93.34,97 v85.72,89.38 | v150.49,65.25 v150.49,93.19
  Bottom 0.254: v146.68,30.96 v146.68,34.77 158.11,34.77 158.11,63.98 156.84,65.25 v150.49,65.25 | v146.68,42.39 U1.23 | v85.72,89.38 84.45,89.38 83.18,90.65 74.29,90.65 73.02,89.38 IC22.5 | v93.34,97 102.23,97 103.5,95.73 130.17,95.73 131.44,97 146.68,97 v150.49,93.19
CA14  (via drill 0.61)
  Top 0.254: v126.36,5.56 v126.36,13.18 | v150.49,5.56 151.76,6.83 153.03,9.37 155.57,9.37 155.57,30.96 156.84,32.23 v156.84,43.66
  Bottom 0.254: v126.36,5.56 v150.49,5.56 | v156.84,43.66 155.57,44.93 U1.24 | v126.36,13.18 IC11.14
CA15  (via drill 0.61)
  Top 0.254: v120.01,15.72 v120.01,46.2
  Bottom 0.254: v120.01,46.2 139.06,46.2 140.33,47.47 U1.25 | v120.01,15.72 IC11.13
CD0  (via drill 0.61)
  Top 0.254: v156.84,19.53 158.11,20.8 158.11,44.93 v156.84,46.2 | v153.03,67.79 153.03,65.25 P2.A22
  Bottom 0.254: v156.84,19.53 141.6,19.53 139.06,22.07 IC3.18 | v156.84,46.2 156.84,63.98 P2.A22 | v153.03,67.79 U1.33
CD1  (via drill 0.61)
  Top 0.254: v132.71,63.98 132.71,20.8 131.44,19.53 IC3.17
  Bottom 0.254: v132.71,63.98 133.98,65.25 U1.32 145.41,65.25 147.95,62.71 153.03,62.71 P2.A21
CD2  (via drill 0.61)
  Top 0.254: v133.98,62.71 133.98,20.8 132.71,19.53 132.71,18.26 131.44,16.99 IC3.16
  Bottom 0.254: v133.98,62.71 U1.31 145.41,62.71 147.95,60.17 153.03,60.17 P2.A20
CD3  (via drill 0.61)
  Top 0.254: v140.33,14.45 v140.33,60.17
  Bottom 0.254: v140.33,60.17 U1.30 145.41,60.17 147.95,57.63 153.03,57.63 P2.A19 | IC3.15 v140.33,14.45
CD4  (via drill 0.61)
  Top 0.254: v132.71,9.37 132.71,10.64 131.44,11.91 IC3.14 | v139.06,9.37 v139.06,57.63
  Bottom 0.254: v132.71,9.37 v139.06,9.37 | v139.06,57.63 U1.29 144.14,57.63 146.68,55.09 153.03,55.09 P2.A18
CD5  (via drill 0.61)
  Top 0.254: v127.63,27.15 127.63,10.64 128.9,9.37 IC3.13 | v135.25,28.42 v135.25,51.28
  Bottom 0.254: v127.63,27.15 127.63,28.42 v135.25,28.42 | v135.25,51.28 139.06,55.09 U1.28 144.14,55.09 146.68,52.55 153.03,52.55 P2.A17
CD6  (via drill 0.61)
  Top 0.254: v150.49,6.83 151.76,9.37 151.76,47.47 153.03,48.74 P2.A16
  Bottom 0.254: IC3.12 v150.49,6.83 | U1.27 145.41,52.55 147.95,50.01 153.03,50.01 P2.A16
CD7  (via drill 0.61)
  Top 0.254: v155.57,32.23 155.57,44.93 P2.A15
  Bottom 0.254: v155.57,32.23 158.11,32.23 158.11,10.64 151.76,4.29 IC3.11 | U1.26 145.41,50.01 147.95,47.47 153.03,47.47 P2.A15
CPHI1
  Bottom 0.254: U1.3 140.33,80.49 141.6,79.22 146.68,79.22 P2.C27
CPHI2
  Top 0.254: P2.C26 144.14,79.22 144.14,81.76 U1.39
CR/-W  (via drill 0.61)
  Top 0.254: IC1.13 IC1.14 | IC3.1 v122.55,38.58 122.55,39.85 v123.82,41.12 | U1.34 144.14,69.06 v144.14,41.12
  Bottom 0.254: U1.34 147.95,70.33 P2.C25 | v122.55,38.58 121.28,39.85 IC1.13 | v123.82,41.12 v144.14,41.12
CSO  (via drill 0.61)
  Top 0.254: U1.38 141.6,81.76 141.6,91.92 142.87,93.19 RN1.5 | P2.A25 155.57,72.87 v155.57,80.49
  Bottom 0.254: U1.38 v155.57,80.49
CSYNC
  Bottom 0.254: U1.7 140.33,70.33 141.6,69.06 P2.C24
ERR
  Bottom 0.254: P3.A 56.51,74.14 71.75,74.14 73.02,75.41 79.37,75.41 80.64,76.68 IC7.3
EXT  (via drill 0.61)
  Top 0.254: v89.53,44.93 89.53,48.74 88.26,50.01 IC15.2 | v97.15,43.66 98.42,42.39 98.42,33.5 99.69,32.23 99.69,29.69 98.42,28.42 98.42,18.26 99.69,16.99 IC4.6
  Bottom 0.254: IC4.6 102.23,16.99 103.5,18.26 112.39,18.26 113.66,16.99 IC16.6 | v89.53,44.93 92.07,43.66 v97.15,43.66
GND  (via drill 0.61)
  Top 0.254: 107.31,89.38 IC2.1 | IC20.7 69.21,37.31
  Top 0.406: IC1.1 IC2.10 107.31,66.52 108.58,67.79 108.58,88.11 107.31,89.38 | U1.1 122.55,80.49 122.55,71.6 125.09,69.06 125.09,66.52 C10.2 | v81.91,66.52 JP2.1 78.1,71.6 | P2.A28 P2.A29 P2.A30 P2.A31 P2.A32 | C3.2 75.56,66.52 78.1,69.06 78.1,71.6 | IC22.7 78.1,71.6 | v95.88,88.11 C5.2 | P1.C1 10.79,5.56 9.52,4.29 JP1.3 | IC6.8 33.65,74.14 33.65,67.79 C17.1 32.38,67.79 31.11,70.33 29.84,70.33 29.84,76.68 31.11,77.95 31.11,80.49 32.38,81.76 IC6.5 | v51.43,75.41 v51.43,63.98 | P1.A28 P1.A29 P1.A30 P1.A31 P1.A32 | C4.2 60.32,94.46 60.32,97 40,97 C2.2 v40,81.76 | IC27.10 C20.1 | 51.43,41.12 51.43,38.58 50.16,37.31 IC10.10 50.16,36.04 50.16,30.96 v52.7,27.15 51.43,25.88 51.43,23.34 52.7,22.07 52.7,11.91 v51.43,10.64 | 51.43,41.12 50.16,42.39 IC10.8 | 51.43,41.12 51.43,44.93 IC10.6 | C18.1 38.73,28.42 40,27.15 IC26.10 | IC18.10 C23.1 26.03,32.23 26.03,46.2 IC24.7 | P2.C1 149.22,8.1 v144.14,3.02 | IC28.10 C14.1 69.21,37.31 | IC5.10 83.18,27.15 81.91,28.42 C22.1 81.91,32.23 IC15.7 | IC16.10 C6.2 | C21.1 IC4.10 | v104.77,30.96 104.77,34.77 IC1.10 | IC11.8 C19.1 144.14,36.04 U1.21 | P2.A1 153.03,11.91 v153.03,27.15 | v19.68,47.47 19.68,74.14 IC14.8 | C16.1 v130.17,53.82 | IC10.15 55.24,47.47 53.97,46.2 53.97,43.66 55.24,42.39 IC10.13
  Bottom 0.254: 22.22,94.46 C1.2 | 113.66,27.15 IC16.10 117.47,27.15
  Bottom 0.406: C7.2 118.74,85.57 U1.1 | C9.2 100.96,56.36 102.23,57.63 IC1.1 107.31,57.63 108.58,56.36 116.2,56.36 C8.2 125.09,55.09 126.36,53.82 v130.17,53.82 | C10.2 108.58,65.25 107.31,66.52 IC2.10 | v81.91,66.52 IC7.7 | P3.7 73.02,72.87 74.29,71.6 JP2.1 | P2.A32 P2.C32 128.9,89.38 127.63,90.65 109.85,90.65 108.58,89.38 IC2.1 104.77,89.38 103.5,88.11 v95.88,88.11 IC22.7 | P1.A1 P1.C1 C26.- v51.43,10.64 81.91,10.64 83.18,11.91 IC5.4 | IC14.8 19.68,74.14 20.95,72.87 27.3,72.87 28.57,74.14 IC6.8 38.73,74.14 40,75.41 v51.43,75.41 | v51.43,63.98 C15.1 | C2.2 38.73,94.46 22.22,94.46 15.87,94.46 P1.C32 P1.A32 | IC6.5 v40,81.76 | IC10.8 IC10.13 | v52.7,27.15 IC27.10 | C23.1 C18.1 | IC10.6 37.46,47.47 36.19,46.2 32.38,46.2 31.11,47.47 IC24.7 v19.68,47.47 | v144.14,3.02 125.09,3.02 123.82,4.29 IC3.10 | P2.A1 P2.C1 | C14.1 C22.1 | 113.66,27.15 109.85,30.96 v104.77,30.96 C21.1 99.69,29.69 88.26,29.69 85.72,27.15 IC5.10 | 117.47,27.15 120.01,29.69 128.9,29.69 C16.1 142.87,30.96 C19.1 146.68,29.69 147.95,27.15 v153.03,27.15 | IC10.10 51.43,37.31 52.7,38.58 57.78,38.58 59.05,37.31 IC20.7
N$1  (via drill 0.7)
  Top 0.254: IC24.13 v37.46,62.71 | v93.34,63.98 IC7.8
  Bottom 0.254: v37.46,62.71 89.53,62.71 90.8,63.98 v93.34,63.98
N$2  (via drill 0.61)
  Top 0.254: v104.77,6.83 106.04,8.1 111.12,8.1 111.12,9.37 112.39,10.64 113.66,9.37 113.66,8.1 114.93,6.83 IC16.2
  Bottom 0.254: IC4.2 v104.77,6.83
N$3
  Top 0.254: IC11.1 142.87,8.1 141.6,6.83 133.98,6.83 133.98,19.53 135.25,20.8 IC11.11
N$8  (via drill 0.61)
  Top 0.254: v97.15,4.29 95.88,5.56 95.88,13.18 94.61,14.45 IC4.16 | v120.01,4.29 120.01,5.56 118.74,6.83 118.74,10.64 117.47,11.91 IC16.4
  Bottom 0.254: v97.15,4.29 97.15,1.75 117.47,1.75 v120.01,4.29
N$19  (via drill 0.61)
  Top 0.254: v71.75,8.1 71.75,25.88 67.94,25.88 65.4,28.42 65.4,32.23 66.67,33.5 v66.67,52.55 | v65.4,8.1 64.13,6.83 64.13,3.02 53.97,3.02 51.43,5.56 40,5.56 36.19,1.75 23.49,1.75 23.49,5.56 22.22,6.83 v22.22,8.1
  Bottom 0.254: v65.4,8.1 v71.75,8.1 | v22.22,8.1 17.14,8.1 15.87,9.37 9.52,9.37 6.98,6.83 6.98,5.56 10.79,5.56 12.06,4.29 JP1.2 | v66.67,52.55 IC10.17
N$40
  Top 0.254: IC15.1 85.72,52.55 85.72,67.79 86.99,69.06 IC7.6
N$48  (via drill 0.61)
  Top 0.254: IC5.9 83.18,24.61 81.91,23.34 81.91,20.8 89.53,20.8 89.53,38.58 88.26,39.85 IC15.6 | v83.18,39.85 v83.18,51.28
  Bottom 0.254: v83.18,51.28 73.02,51.28 71.75,52.55 IC20.1 | IC15.6 v83.18,39.85
N$59  (via drill 0.61)
  Top 0.254: v86.99,34.77 86.99,23.34 85.72,22.07 IC5.8 | v73.02,39.85 73.02,48.74 71.75,50.01 IC20.2
  Bottom 0.254: v86.99,34.77 88.26,36.04 | 88.26,36.04 90.8,36.04 92.07,37.31 IC15.8 | v73.02,39.85 73.02,38.58 75.56,36.04 88.26,36.04
N$61  (via drill 0.61)
  Top 0.254: 86.99,15.72 81.91,15.72 79.37,18.26 79.37,34.77 76.83,34.77 75.56,36.04 75.56,38.58 76.83,39.85 IC20.9 | 86.99,15.72 86.99,18.26 85.72,19.53 IC5.7 | v100.96,44.93 100.96,34.77 103.5,32.23 103.5,16.99 104.77,15.72 104.77,13.18 102.23,10.64 97.15,10.64 97.15,14.45 95.88,15.72 86.99,15.72
  Bottom 0.254: v100.96,44.93 IC15.11
N$62
  Top 0.254: IC5.6 83.18,16.99 80.64,19.53 80.64,41.12 79.37,42.39 IC20.10
  Bottom 0.254: IC20.10 79.37,42.39 84.45,47.47 IC15.3
N$63  (via drill 0.61)
  Top 0.254: v75.56,47.47 75.56,53.82 73.02,56.36 73.02,70.33 74.29,71.6 v74.29,77.95 | v84.45,79.22 85.72,79.22 85.72,80.49 86.99,81.76 IC7.1
  Bottom 0.254: v74.29,77.95 79.37,77.95 80.64,79.22 v84.45,79.22 | IC20.3 v75.56,47.47
N$64  (via drill 0.61)
  Top 0.254: v83.18,37.31 84.45,38.58 84.45,69.06 85.72,70.33 85.72,77.95 86.99,79.22 IC7.2
  Bottom 0.254: IC20.8 v83.18,37.31
N$66  (via drill 0.61)
  Top 0.254: IC7.4 IC7.5 | v79.37,81.76 80.64,79.22 80.64,75.41 JP2.2
  Bottom 0.254: v79.37,81.76 67.94,81.76 R1.1 | JP2.2 IC7.4
NOEXEC  (via drill 0.61)
  Top 0.254: v90.8,42.39 v90.8,33.5 90.8,25.88 92.07,24.61 IC4.12 | v112.39,32.23 112.39,24.61 114.93,22.07 IC16.8
  Bottom 0.254: v90.8,42.39 IC15.10 | v112.39,32.23 111.12,33.5 104.77,33.5 103.5,34.77 97.15,34.77 95.88,33.5 v90.8,33.5
NOEXECERR  (via drill 0.61)
  Top 0.254: v74.29,28.42 v74.29,38.58
  Bottom 0.254: v74.29,38.58 92.07,38.58 93.34,39.85 IC15.9 | v74.29,28.42 71.75,25.88 67.94,25.88 66.67,24.61 65.4,24.61 64.13,25.88 64.13,27.15 62.86,28.42 59.05,28.42 57.78,29.69 46.35,29.69 43.81,27.15 43.81,25.88 15.87,25.88 12.06,29.69 9.52,29.69 9.52,32.23 8.25,33.5 P1.A10
NOTMAPD  (via drill 0.61)
  Top 0.254: IC4.15 94.61,16.99 95.88,18.26 95.88,32.23 v92.07,36.04 92.07,48.74 93.34,50.01 IC15.13 | v118.74,36.04 118.74,20.8 117.47,19.53 IC16.7
  Bottom 0.254: v92.07,36.04 95.88,36.04 97.15,37.31 103.5,37.31 104.77,36.04 v118.74,36.04
NOTMAPDERR  (via drill 0.61, 0.7)
  Top 0.254: v81.91,43.66 75.56,43.66 74.29,42.39 74.29,39.85 73.02,38.58 v67.94,38.58 | v59.05,39.85 57.78,41.12 v53.97,41.12 | v36.19,41.12 36.19,34.77 34.92,34.77 v33.65,36.04
  Bottom 0.254: IC15.12 90.8,47.47 89.53,46.2 84.45,46.2 v81.91,43.66 | v59.05,39.85 60.32,38.58 v67.94,38.58 | v36.19,41.12 v53.97,41.12 | P1.A11 8.25,36.04 9.52,37.31 31.11,37.31 32.38,36.04 v33.65,36.04
PHI0  (via drill 0.7)
  Top 0.254: v32.38,76.68 33.65,75.41 36.19,75.41 37.46,74.14 v37.46,70.33 | v125.09,72.87 126.36,74.14 128.9,74.14 130.17,75.41 v130.17,76.68 | v98.42,70.33 98.42,71.6 97.15,72.87 v93.34,72.87 | v76.83,72.87 76.83,70.33 v75.56,69.06
  Bottom 0.254: P1.C28 14.6,79.22 15.87,77.95 29.84,77.95 31.11,76.68 v32.38,76.68 | v37.46,70.33 42.54,70.33 43.81,69.06 59.05,69.06 60.32,70.33 65.4,70.33 66.67,69.06 v75.56,69.06 | v98.42,70.33 114.93,70.33 117.47,72.87 v125.09,72.87 | v130.17,76.68 140.33,76.68 141.6,77.95 U1.37 | v76.83,72.87 v93.34,72.87
RDYOUT  (via drill 0.61)
  Top 0.254: v32.38,52.55 32.38,57.63 31.11,58.9 v31.11,62.71 | v50.16,63.98 v50.16,80.49 | v62.86,80.49 65.4,77.95 P3.E
  Bottom 0.254: v31.11,62.71 32.38,62.71 33.65,63.98 v50.16,63.98 | v50.16,80.49 60.32,80.49 61.59,81.76 v62.86,80.49 | IC24.5 v32.38,52.55
STEPEN  (via drill 0.61)
  Top 0.254: P3.6 69.21,74.14 71.75,74.14 v71.75,76.68 | v93.34,77.95 93.34,74.14 92.07,72.87 92.07,61.44 95.88,57.63 95.88,53.82 97.15,52.55 v97.15,47.47 | v126.36,43.66 126.36,14.45 125.09,13.18 120.01,13.18 118.74,14.45 IC16.5
  Bottom 0.254: IC4.5 104.77,14.45 106.04,15.72 112.39,15.72 113.66,14.45 IC16.5 | v71.75,76.68 79.37,76.68 80.64,77.95 v93.34,77.95 | v97.15,47.47 98.42,46.2 117.47,46.2 120.01,43.66 v126.36,43.66
VCC  (via drill 0.61)
  Top 0.406: P1.C3 P1.C2 13.33,10.64 13.33,9.37 C26.+ JP1.1 | C3.1 IC20.14 | C9.1 92.07,53.82 93.34,52.55 IC15.14 | C8.1 v117.47,67.79 | IC7.14 94.61,81.76 93.34,83.03 C5.1 94.61,86.84 v94.61,94.46 | IC2.20 C7.1 117.47,91.92 132.71,91.92 RN1.1 | C10.1 121.28,70.33 121.28,84.3 v126.36,89.38 | v109.85,57.63 v109.85,53.82 109.85,38.58 111.12,37.31 111.12,33.5 v109.85,32.23 | P2.C2 P2.C3 | C19.2 141.6,9.37 139.06,8.1 IC11.16 | IC3.20 128.9,28.42 C16.2 | IC14.16 C1.1 | IC6.16 C2.1 C4.1 57.78,94.46 56.51,89.38 R1.2 | v57.78,32.23 57.78,36.04 IC10.11 | C17.2 IC24.14 | C15.2 IC10.20 57.78,60.17 61.59,63.98 v61.59,77.95 v61.59,84.3 | C20.2 51.43,32.23 51.43,37.31 52.7,38.58 52.7,52.55 | 52.7,52.55 IC10.4 | 52.7,52.55 v52.7,57.63 v52.7,60.17 | v42.54,52.55 v42.54,66.52
  Bottom 0.254: JP1.1 14.6,4.29
  Bottom 0.406: 14.6,4.29 IC18.20 23.49,4.29 24.76,5.56 29.84,5.56 31.11,4.29 IC26.20 34.92,4.29 36.19,3.02 45.08,3.02 | 45.08,3.02 46.35,4.29 IC27.20 | 59.05,3.02 60.32,4.29 IC28.20 | 45.08,3.02 59.05,3.02 | 59.05,3.02 71.75,3.02 73.02,4.29 IC5.20 78.1,4.29 79.37,3.02 85.72,3.02 86.99,4.29 86.99,5.56 90.8,5.56 92.07,4.29 IC4.20 94.61,4.29 95.88,5.56 98.42,5.56 98.42,4.29 99.69,3.02 106.04,3.02 107.31,4.29 IC16.20 IC16.1 117.47,4.29 118.74,5.56 123.82,5.56 126.36,8.1 IC11.16 141.6,8.1 142.87,9.37 155.57,9.37 155.57,11.91 153.03,11.91 151.76,13.18 P2.C2 | C9.1 90.8,56.36 89.53,55.09 79.37,55.09 C3.1 | C8.1 IC1.20 v109.85,57.63 | U1.8 C10.1 v117.47,67.79 | RN1.1 v94.61,94.46 | v126.36,89.38 C7.1 | v109.85,53.82 97.15,53.82 95.88,52.55 IC15.14 | C16.2 126.36,32.23 114.93,32.23 C6.1 111.12,30.96 v109.85,32.23 99.69,32.23 C21.2 C22.2 83.18,29.69 67.94,29.69 C14.2 65.4,30.96 64.13,32.23 v57.78,32.23 53.97,32.23 C20.2 C18.2 40,32.23 26.03,32.23 C23.2 | C19.2 136.52,29.69 136.52,27.15 IC3.20 | IC14.16 31.11,91.92 32.38,90.65 38.73,90.65 40,91.92 IC6.16 | C4.1 IC22.14 | v52.7,57.63 IC10.2 | v52.7,60.17 IC10.20 | v42.54,66.52 C17.2 | IC10.4 v42.54,52.55 | v61.59,84.3 60.32,83.03 R1.2 | P3.G 69.21,76.68 62.86,76.68 v61.59,77.95
WPROT  (via drill 0.61)
  Top 0.254: v97.15,24.61 v97.15,41.12 | v117.47,37.31 117.47,32.23 114.93,32.23 114.93,29.69 113.66,28.42 113.66,25.88 114.93,24.61 IC16.9
  Bottom 0.254: v97.15,24.61 IC4.9 | IC15.5 89.53,42.39 90.8,41.12 v97.15,41.12 102.23,41.12 104.77,38.58 116.2,38.58 v117.47,37.31
WPROTERR  (via drill 0.61)
  Top 0.254: v81.91,34.77 v81.91,42.39 | v34.92,36.04 33.65,38.58 v33.65,44.93
  Bottom 0.254: v81.91,42.39 83.18,42.39 85.72,44.93 IC15.4 | v81.91,34.77 75.56,34.77 74.29,36.04 53.97,36.04 52.7,34.77 47.62,34.77 46.35,36.04 v34.92,36.04 | v33.65,44.93 32.38,44.93 31.11,46.2 20.95,46.2 19.68,44.93 9.52,44.93 6.98,42.39 6.98,38.58 P1.A12

## Text on the board
Top: CSA-AUXCPU-V1.0C | (C) A. Fachat